# EasyEDA schematic Schematic_EasyEDA.json
TITLE: Steering Controller; REV: 1.0; Date: 2020-11-30; Sheet: 1/1; Drawn By: Liam; Company: Liamtronix
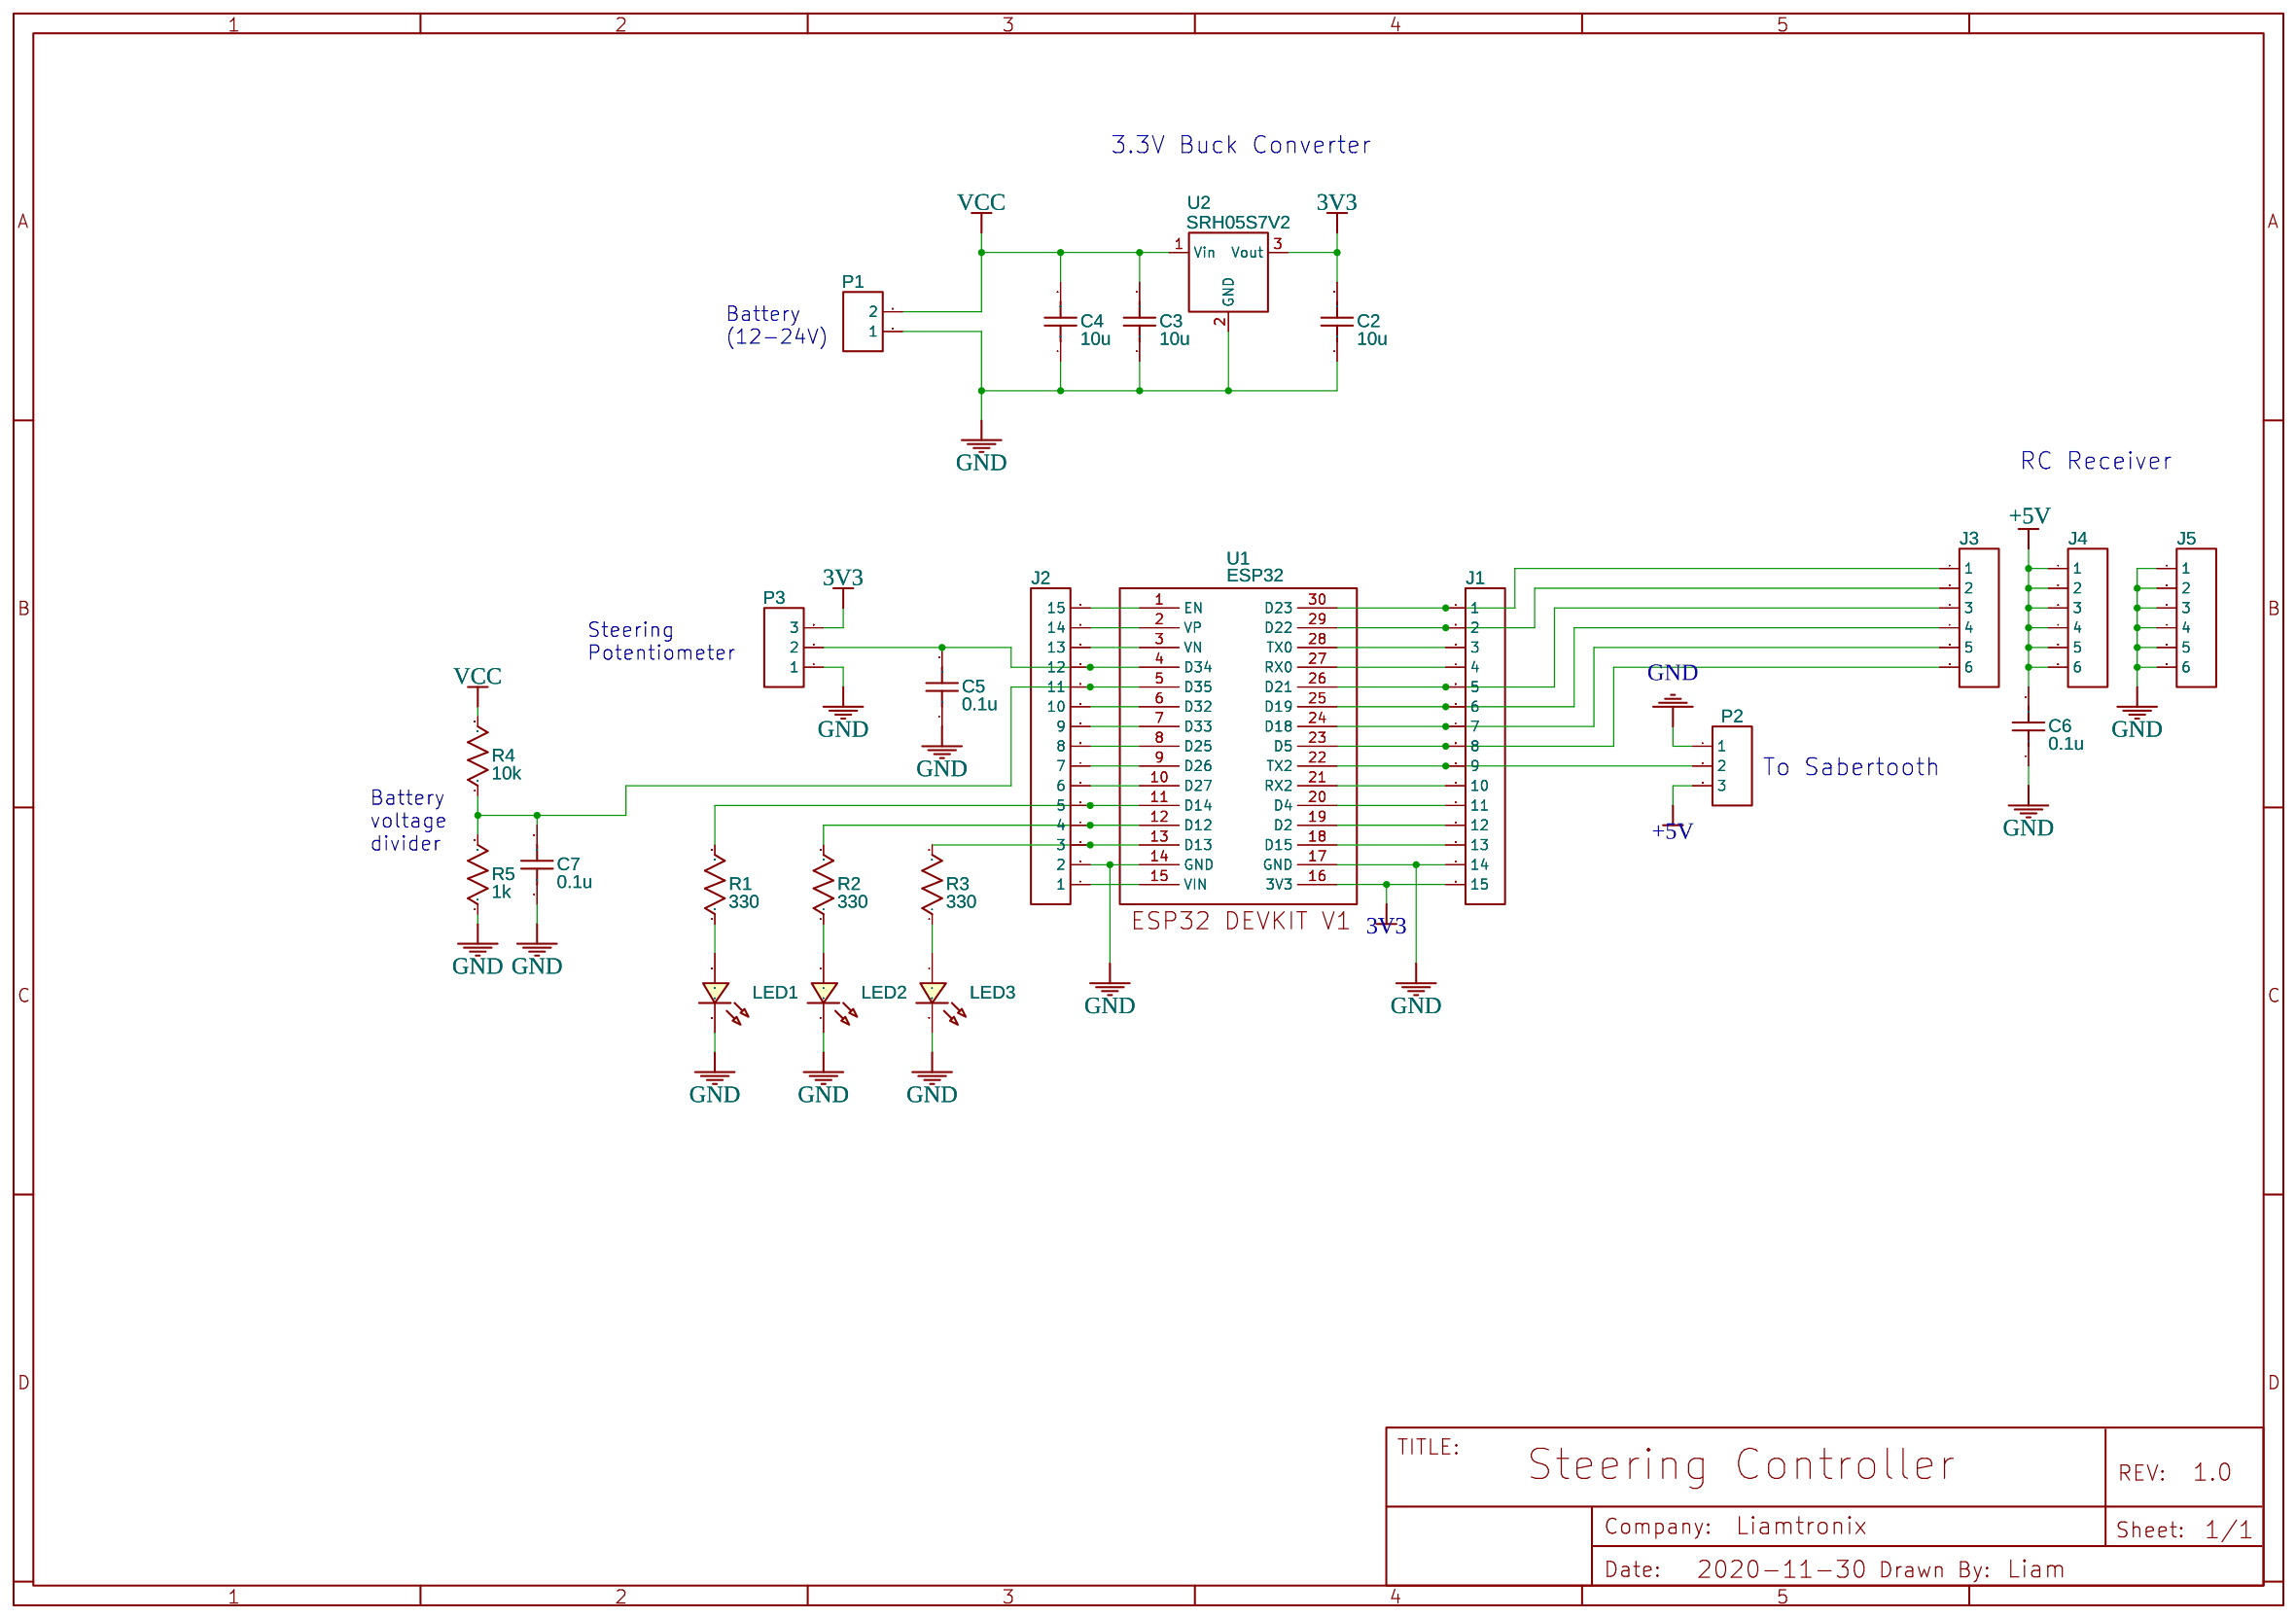
[diagram p0: schematic sheet]

## Parts
C2  10u  [C1206]
C3  10u  [C1206]
C4  10u  [C1206]
C5  0.1u  [C1206]
C6  0.1u  [C1206]
C7  0.1u  [C1206]
J1  HDR-M-2.54_1x15  [HDR-M-2.54_1X15]
J2  HDR-M-2.54_1x15  [HDR-M-2.54_1X15]
J3  HDR-M-2.54_1x6  [HDR-M-2.54_1X6]
J4  HDR-M-2.54_1x6  [HDR-M-2.54_1X6]
J5  HDR-M-2.54_1x6  [HDR-M-2.54_1X6]
LED1  LED-TH-3mm_R  [LED-TH_BD3.0_RED]
LED2  LED-TH-3mm_R  [LED-TH_BD3.0_RED]
LED3  LED-TH-3mm_R  [LED-TH_BD3.0_RED]
P1  CONN-TH_2P-P5.00  [CONN-TH_2P-P5.00]
P2  CONN-TH_3P-P5.00  [CONN-TH_3P-P5.08]
P3  CONN-TH_3P-P5.00  [CONN-TH_3P-P5.08]
R1  330  [R1206]
R2  330  [R1206]
R3  330  [R1206]
R4  10k  [R1206]
R5  1k  [R1206]
U1  ESP32  [ESP32]
U2  SRH05S7V2  [SIP3]

## Library data of the parts
C2-C4 = C_1206_US: Supplier Part: 1276-6736-1-ND; Supplier: Digi-Key; Contributor: LCEDA_Lib
C5-C7 = C_1206_US: Contributor: LCEDA_Lib
J1 J2 = HDR-M-2.54_1x15: Supplier Part: C124373; Supplier: LCSC; Contributor: LCEDA_Lib
J3-J5 = HDR-M-2.54_1x6: Supplier Part: C190819; Supplier: LCSC; Contributor: LCEDA_Lib
LED1-LED3 = LED-TH-3mm_R: Manufacturer: EVERLIGHT(台湾亿光); Manufacturer Part: 204-10SDRD/S530-A3-L; Supplier Part: C84774; Supplier: LCSC; Contributor: LCEDA_Lib
P1 = CONN-TH_2P-P5.00: Supplier: LCSC; Contributor: LCEDA_Lib
P2 P3 = CONN-TH_3P-P5.00: Supplier: LCSC; Contributor: LCEDA_Lib
R1-R5 = R_1206_US: Contributor: LCEDA_Lib
U1 = -: Contributor: philipp.maack
U2 = SRH05S7V2: Manufacturer: XP Power; Supplier: RS-Online; Supplier Part: 174-4675; link: https://uk.rs-online.com/web/p/switching-regulators/1744675/; Contributor: AleksejsSkorodumovs

## Nets
3V3: C2.2 J1.15 P3.3 U1.16(3V3) U2.3(Vout)
+5V: C6.2 J4.1 J4.2 J4.3 J4.4 J4.5 J4.6 P2.3
GND: C2.1 C3.1 C4.1 C5.1 C6.1 C7.1 J1.14 J2.2 J5.1 J5.2 J5.3 J5.4 J5.5 J5.6 LED1.2 LED2.2 LED3.2 P1.1 P2.1 P3.1 R5.1 U1.14(GND) U1.17(GND) U2.2(GND)
VCC: C3.2 C4.2 P1.2 R4.2 U2.1(Vin)
Net-(C5-2): C5.2 J2.12 P3.2 U1.4(D34)
Net-(C7-2): C7.2 J2.11 R4.1 R5.2 U1.5(D35)
Net-(J1-1): J1.1 J3.1 U1.30(D23)
Net-(J1-2): J1.2 J3.2 U1.29(D22)
Net-(J1-3): J1.3 U1.28(TX0)
Net-(J1-4): J1.4 U1.27(RX0)
Net-(J1-5): J1.5 J3.3 U1.26(D21)
Net-(J1-6): J1.6 J3.4 U1.25(D19)
Net-(J1-7): J1.7 J3.5 U1.24(D18)
Net-(J1-8): J1.8 J3.6 U1.23(D5)
Net-(J1-9): J1.9 P2.2 U1.22(TX2)
Net-(J1-10): J1.10 U1.21(RX2)
Net-(J1-11): J1.11 U1.20(D4)
Net-(J1-12): J1.12 U1.19(D2)
Net-(J1-13): J1.13 U1.18(D15)
Net-(J2-1): J2.1 U1.15(VIN)
Net-(J2-3): J2.3 R3.2 U1.13(D13)
Net-(J2-4): J2.4 R2.2 U1.12(D12)
Net-(J2-5): J2.5 R1.2 U1.11(D14)
Net-(J2-6): J2.6 U1.10(D27)
Net-(J2-7): J2.7 U1.9(D26)
Net-(J2-8): J2.8 U1.8(D25)
Net-(J2-9): J2.9 U1.7(D33)
Net-(J2-10): J2.10 U1.6(D32)
Net-(J2-13): J2.13 U1.3(VN)
Net-(J2-14): J2.14 U1.2(VP)
Net-(J2-15): J2.15 U1.1(EN)
Net-(LED1-1): LED1.1 R1.1
Net-(LED2-1): LED2.1 R2.1
Net-(LED3-1): LED3.1 R3.1

## Notes on the sheet
- 3.3V Buck Converter
- Battery
  (12-24V)
- RC Receiver
- Steering
  Potentiometer
- To Sabertooth
- Battery
  voltage
  divider
